# Altium schematic sheet light_panel.schdoc
size 292 x 127 mm
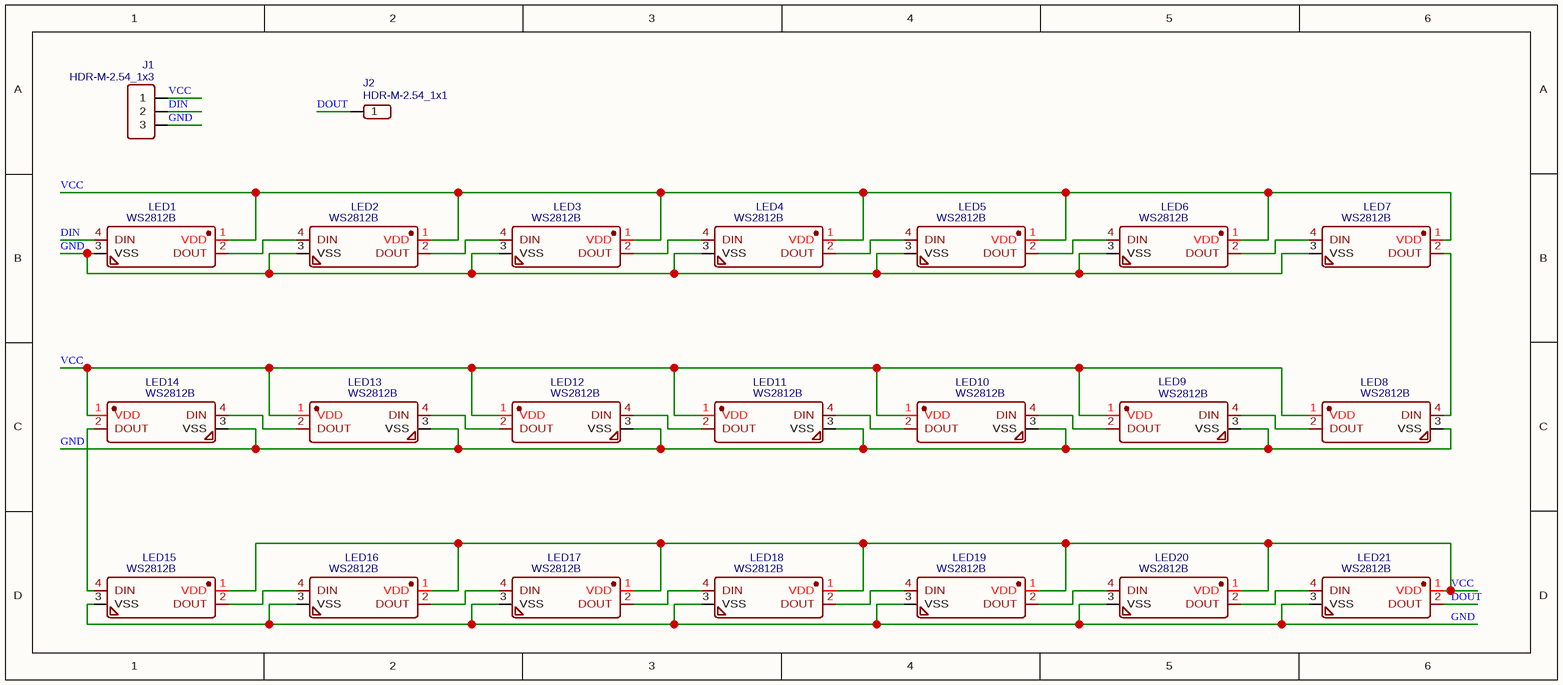
[diagram p0: light_panel.schdoc]

## Parts
J1  HDR-M-2.54_1x3  [HDR-M-2.54_1X3]
J2  HDR-M-2.54_1x1  [HDR-M-2.54_1X1]
LED1  WS2812B  [LED-SMD_4P-L5.0-W5.0-TL]
LED2  WS2812B  [LED-SMD_4P-L5.0-W5.0-TL]
LED3  WS2812B  [LED-SMD_4P-L5.0-W5.0-TL]
LED4  WS2812B  [LED-SMD_4P-L5.0-W5.0-TL]
LED5  WS2812B  [LED-SMD_4P-L5.0-W5.0-TL]
LED6  WS2812B  [LED-SMD_4P-L5.0-W5.0-TL]
LED7  WS2812B  [LED-SMD_4P-L5.0-W5.0-TL]
LED8  WS2812B  [LED-SMD_4P-L5.0-W5.0-TL]
LED9  WS2812B  [LED-SMD_4P-L5.0-W5.0-TL]
LED10  WS2812B  [LED-SMD_4P-L5.0-W5.0-TL]
LED11  WS2812B  [LED-SMD_4P-L5.0-W5.0-TL]
LED12  WS2812B  [LED-SMD_4P-L5.0-W5.0-TL]
LED13  WS2812B  [LED-SMD_4P-L5.0-W5.0-TL]
LED14  WS2812B  [LED-SMD_4P-L5.0-W5.0-TL]
LED15  WS2812B  [LED-SMD_4P-L5.0-W5.0-TL]
LED16  WS2812B  [LED-SMD_4P-L5.0-W5.0-TL]
LED17  WS2812B  [LED-SMD_4P-L5.0-W5.0-TL]
LED18  WS2812B  [LED-SMD_4P-L5.0-W5.0-TL]
LED19  WS2812B  [LED-SMD_4P-L5.0-W5.0-TL]
LED20  WS2812B  [LED-SMD_4P-L5.0-W5.0-TL]
LED21  WS2812B  [LED-SMD_4P-L5.0-W5.0-TL]

## Nets
DIN: J1.2 LED1.4(DIN)
DOUT: J2.1 LED21.2(DOUT)
GND: J1.3 LED1.3(VSS) LED2.3(VSS) LED3.3(VSS) LED4.3(VSS) LED5.3(VSS) LED6.3(VSS) LED7.3(VSS) LED8.3(VSS) LED9.3(VSS) LED10.3(VSS) LED11.3(VSS) LED12.3(VSS) LED13.3(VSS) LED14.3(VSS) LED15.3(VSS) LED16.3(VSS) LED17.3(VSS) LED18.3(VSS) LED19.3(VSS) LED20.3(VSS) LED21.3(VSS)
VCC: J1.1 LED1.1(VDD) LED2.1(VDD) LED3.1(VDD) LED4.1(VDD) LED5.1(VDD) LED6.1(VDD) LED7.1(VDD) LED8.1(VDD) LED9.1(VDD) LED10.1(VDD) LED11.1(VDD) LED12.1(VDD) LED13.1(VDD) LED14.1(VDD) LED15.1(VDD) LED16.1(VDD) LED17.1(VDD) LED18.1(VDD) LED19.1(VDD) LED20.1(VDD) LED21.1(VDD)
NetLED1_2: LED1.2(DOUT) LED2.4(DIN)
NetLED2_2: LED2.2(DOUT) LED3.4(DIN)
NetLED3_2: LED3.2(DOUT) LED4.4(DIN)
NetLED4_2: LED4.2(DOUT) LED5.4(DIN)
NetLED5_2: LED5.2(DOUT) LED6.4(DIN)
NetLED6_2: LED6.2(DOUT) LED7.4(DIN)
NetLED7_2: LED7.2(DOUT) LED8.4(DIN)
NetLED8_2: LED8.2(DOUT) LED9.4(DIN)
NetLED9_2: LED9.2(DOUT) LED10.4(DIN)
NetLED10_2: LED10.2(DOUT) LED11.4(DIN)
NetLED11_2: LED11.2(DOUT) LED12.4(DIN)
NetLED12_2: LED12.2(DOUT) LED13.4(DIN)
NetLED13_2: LED13.2(DOUT) LED14.4(DIN)
NetLED14_2: LED14.2(DOUT) LED15.4(DIN)
NetLED15_2: LED15.2(DOUT) LED16.4(DIN)
NetLED16_2: LED16.2(DOUT) LED17.4(DIN)
NetLED17_2: LED17.2(DOUT) LED18.4(DIN)
NetLED18_2: LED18.2(DOUT) LED19.4(DIN)
NetLED19_2: LED19.2(DOUT) LED20.4(DIN)
NetLED20_2: LED20.2(DOUT) LED21.4(DIN)

## Library data of the parts
J1 = HDR-M-2.54_1x3: Contributor: LCEDA_Lib; BOM_Supplier Part: C180248; BOM_Supplier: LCSC; spicePre: J; spiceSymbolName: HDR-M-2.54_1x3
J2 = HDR-M-2.54_1x1: Contributor: LCEDA_Lib; BOM_Supplier Part: C81276; BOM_Supplier: LCSC; spicePre: J; spiceSymbolName: HDR-M-2.54_1x1
LED1-LED21 = WS2812B: BOM_Manufacturer: Worldsemi; Contributor: LCSC; BOM_Supplier: LCSC; BOM_Manufacturer Part: WS2812B; BOM_Supplier Part: C114585; BOM_JLCPCB Part Class: Extended Part; spicePre: L; spiceSymbolName: WS2812B